# Altium schematic sheet HAMINTORI.SchDoc
size A
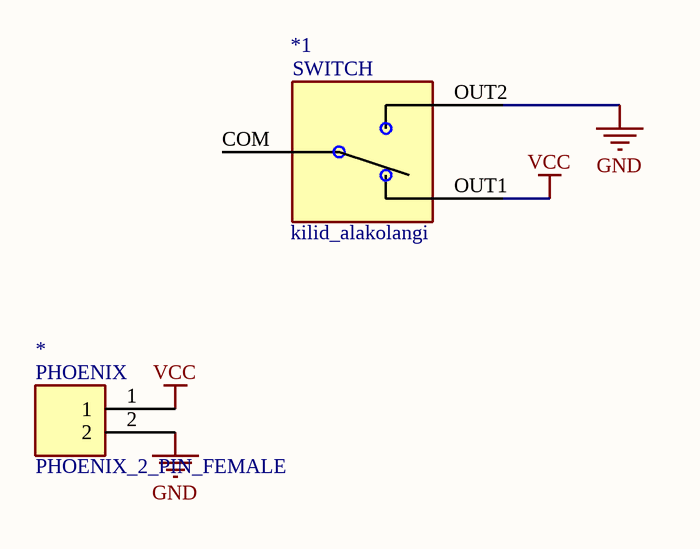
[diagram p0: HAMINTORI.SchDoc]

## Parts
*  PHOENIX_2_PIN_FEMALE  [PHOENIX_2_PIN_FEMALE]
*1  kilid_alakolangi  [kilid_alakolangi]

## Nets
GND: *.2 *1.OUT2
VCC: *.1 *1.OUT1

Not connected (* = marked no-connect by the designer): *1 COM

## Notes on the sheet
- (in symbol kilid_alakolangi) SWITCH
- (in symbol PHOENIX_2_PIN_FEMALE) PHOENIX